# Altium schematic sheet MSP430F149.SCHDOC
size A4; Organization: UNSW Solar Racing Team; Address3: UNSW; Address4: Sydney NSW 2052; Address2: Electrical Engineering; Address1: Rm 109
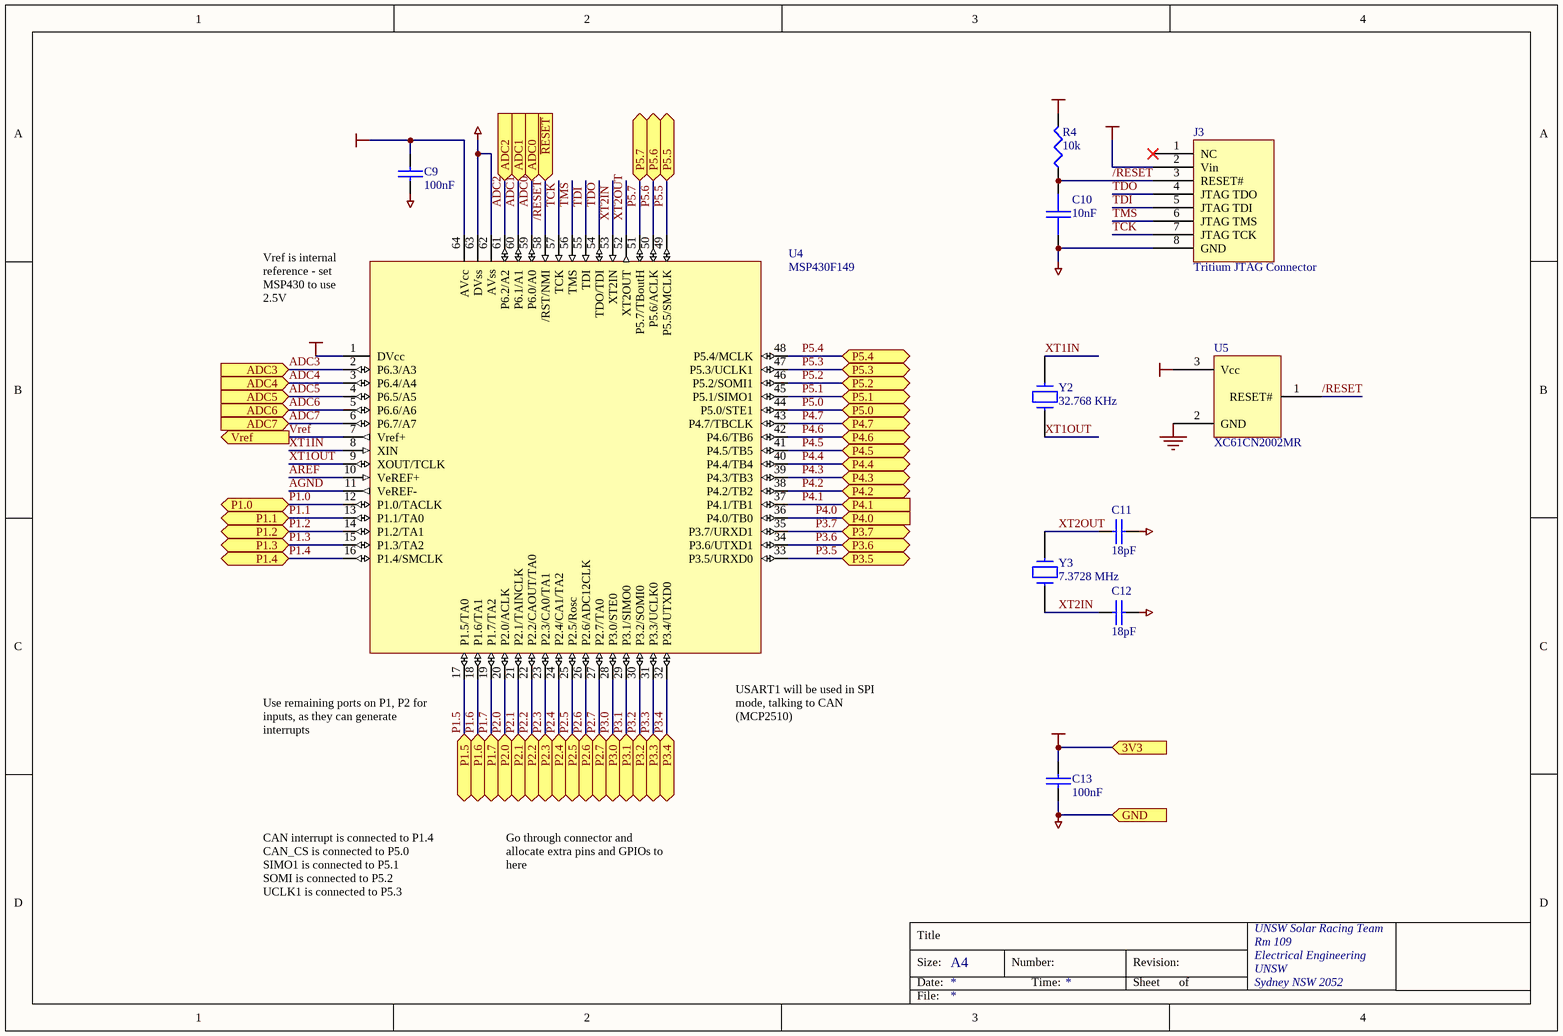
[diagram p0: MSP430F149.SCHDOC]

## Parts
C9  100nF  [0603]
C10  10nF  [0603]
C11  18pF  [0603]
C12  18pF  [0603]
C13  100nF  [0603]
J3  Tritium JTAG Connector  [IDC10]
R4  10k  [0603]
U4  MSP430F149  [QFP64]
U5  XC61CN2002MR  [SOT23(3)]
Y2  32.768 KHz  [WATCHA]
Y3  7.3728 MHz  [HC49/4H]

## Ports
3V3, ADC0 (in), ADC1 (in), ADC2 (in), ADC3 (in), ADC4 (in), ADC5 (in), ADC6 (in), ADC7 (in), GND, P1.0, P1.1, P1.2, P1.3, P1.4, P1.5, P1.6, P1.7, P2.0, P2.1, P2.2, P2.3, P2.4, P2.5, P2.6, P2.7, P3.0, P3.1, P3.2, P3.3, P3.4, P3.5, P3.6, P3.7, P4.0 (in), P4.1 (in), P4.2, P4.3, P4.4, P4.5, P4.6, P4.7, P5.0, P5.1, P5.2, P5.3, P5.4, P5.5, P5.6, P5.7, Vref (out), ~{RESET} (in)

## Nets
3V3: C9.1 C13.1 J3.2(Vin) R4.2 U4.1(DVcc) U4.64(AVcc) U5.3(Vcc) ; port 3V3
GND: C9.2 C10.2 C11.2 C12.2 C13.2 J3.8(GND) U4.62(AVss) U4.63(DVss) U5.2(GND) ; port GND
/RESET: C10.1 J3.3(RESET#) R4.1 U4.58(/RST/NMI) U5.1(RESET#) ; port ~{RESET}
ADC0: U4.59(P6.0/A0) ; port ADC0
ADC1: U4.60(P6.1/A1) ; port ADC1
ADC2: U4.61(P6.2/A2) ; port ADC2
ADC3: U4.2(P6.3/A3) ; port ADC3
ADC4: U4.3(P6.4/A4) ; port ADC4
ADC5: U4.4(P6.5/A5) ; port ADC5
ADC6: U4.5(P6.6/A6) ; port ADC6
ADC7: U4.6(P6.7/A7) ; port ADC7
AGND: U4.11(VeREF-)
AREF: U4.10(VeREF+)
P1.0: U4.12(P1.0/TACLK) ; port P1.0
P1.1: U4.13(P1.1/TA0) ; port P1.1
P1.2: U4.14(P1.2/TA1) ; port P1.2
P1.3: U4.15(P1.3/TA2) ; port P1.3
P1.4: U4.16(P1.4/SMCLK) ; port P1.4
P1.5: U4.17(P1.5/TA0) ; port P1.5
P1.6: U4.18(P1.6/TA1) ; port P1.6
P1.7: U4.19(P1.7/TA2) ; port P1.7
P2.0: U4.20(P2.0/ACLK) ; port P2.0
P2.1: U4.21(P2.1/TAINCLK) ; port P2.1
P2.2: U4.22(P2.2/CAOUT/TA0) ; port P2.2
P2.3: U4.23(P2.3/CA0/TA1) ; port P2.3
P2.4: U4.24(P2.4/CA1/TA2) ; port P2.4
P2.5: U4.25(P2.5/Rosc) ; port P2.5
P2.6: U4.26(P2.6/ADC12CLK) ; port P2.6
P2.7: U4.27(P2.7/TA0) ; port P2.7
P3.0: U4.28(P3.0/STE0) ; port P3.0
P3.1: U4.29(P3.1/SIMO0) ; port P3.1
P3.2: U4.30(P3.2/SOMI0) ; port P3.2
P3.3: U4.31(P3.3/UCLK0) ; port P3.3
P3.4: U4.32(P3.4/UTXD0) ; port P3.4
P3.5: U4.33(P3.5/URXD0) ; port P3.5
P3.6: U4.34(P3.6/UTXD1) ; port P3.6
P3.7: U4.35(P3.7/URXD1) ; port P3.7
P4.0: U4.36(P4.0/TB0) ; port P4.0
P4.1: U4.37(P4.1/TB1) ; port P4.1
P4.2: U4.38(P4.2/TB2) ; port P4.2
P4.3: U4.39(P4.3/TB3) ; port P4.3
P4.4: U4.40(P4.4/TB4) ; port P4.4
P4.5: U4.41(P4.5/TB5) ; port P4.5
P4.6: U4.42(P4.6/TB6) ; port P4.6
P4.7: U4.43(P4.7/TBCLK) ; port P4.7
P5.0: U4.44(P5.0/STE1) ; port P5.0
P5.1: U4.45(P5.1/SIMO1) ; port P5.1
P5.2: U4.46(P5.2/SOMI1) ; port P5.2
P5.3: U4.47(P5.3/UCLK1) ; port P5.3
P5.4: U4.48(P5.4/MCLK) ; port P5.4
P5.5: U4.49(P5.5/SMCLK) ; port P5.5
P5.6: U4.50(P5.6/ACLK) ; port P5.6
P5.7: U4.51(P5.7/TBoutH) ; port P5.7
TCK: J3.7(JTAG_TCK) U4.57(TCK)
TDI: J3.5(JTAG_TDI) U4.55(TDI)
TDO: J3.4(JTAG_TDO) U4.54(TDO/TDI)
TMS: J3.6(JTAG_TMS) U4.56(TMS)
Vref: U4.7(Vref+) ; port Vref
XT1IN: U4.8(XIN) Y2.2
XT1OUT: U4.9(XOUT/TCLK) Y2.1
XT2IN: C12.1 U4.53(XT2IN) Y3.1
XT2OUT: C11.1 U4.52(XT2OUT) Y3.2

Not connected (* = marked no-connect by the designer): J3 1(NC)*

## Notes on the sheet
- (near U4) Vref is internal reference - set MSP430 to use 2.5V
- (near U4) Use remaining ports on P1, P2 for inputs, as they can generate interrupts
- (near U4) USART1 will be used in SPI mode, talking to CAN (MCP2510)
- CAN interrupt is connected to P1.4
  CAN_CS is connected to P5.0
  SIMO1 is connected to P5.1
  SOMI is connected to P5.2
  UCLK1 is connected to P5.3
- Go through connector and allocate extra pins and GPIOs to here
- Title
- Size:
- Date:
- A4
- Number:
- Time:
- Revision:
- Sheet
- of
- File:

## Library data of the parts
C9-C13 = CAP: Capacitor
  C9 C13: Farnell: 753-567; Price: 0.31
  C10: Farnell: 722-236; Price: 0.15
  C11 C12: Farnell: 721-992; Price: 0.11
J3 = 430F_JTAG_TRITIUM: Tritium JTAG interface for MSP430; Farnell: 511-808; Price: 1.32
R4 = RES1: Resistor; Farnell: 612-601; Price: 0.11
U4 = MSP430F14X: Farnell: NA
U5 = XC61F: SOT23 reset generator; Farnell: NA
Y2 Y3 = CRYSTAL
  Y2: Farnell: 103-868
  Y3: Farnell: 485-111; Price: 3.38